# EAGLE board 6matrix (EAGLE 9.3.1), part 1 of 2
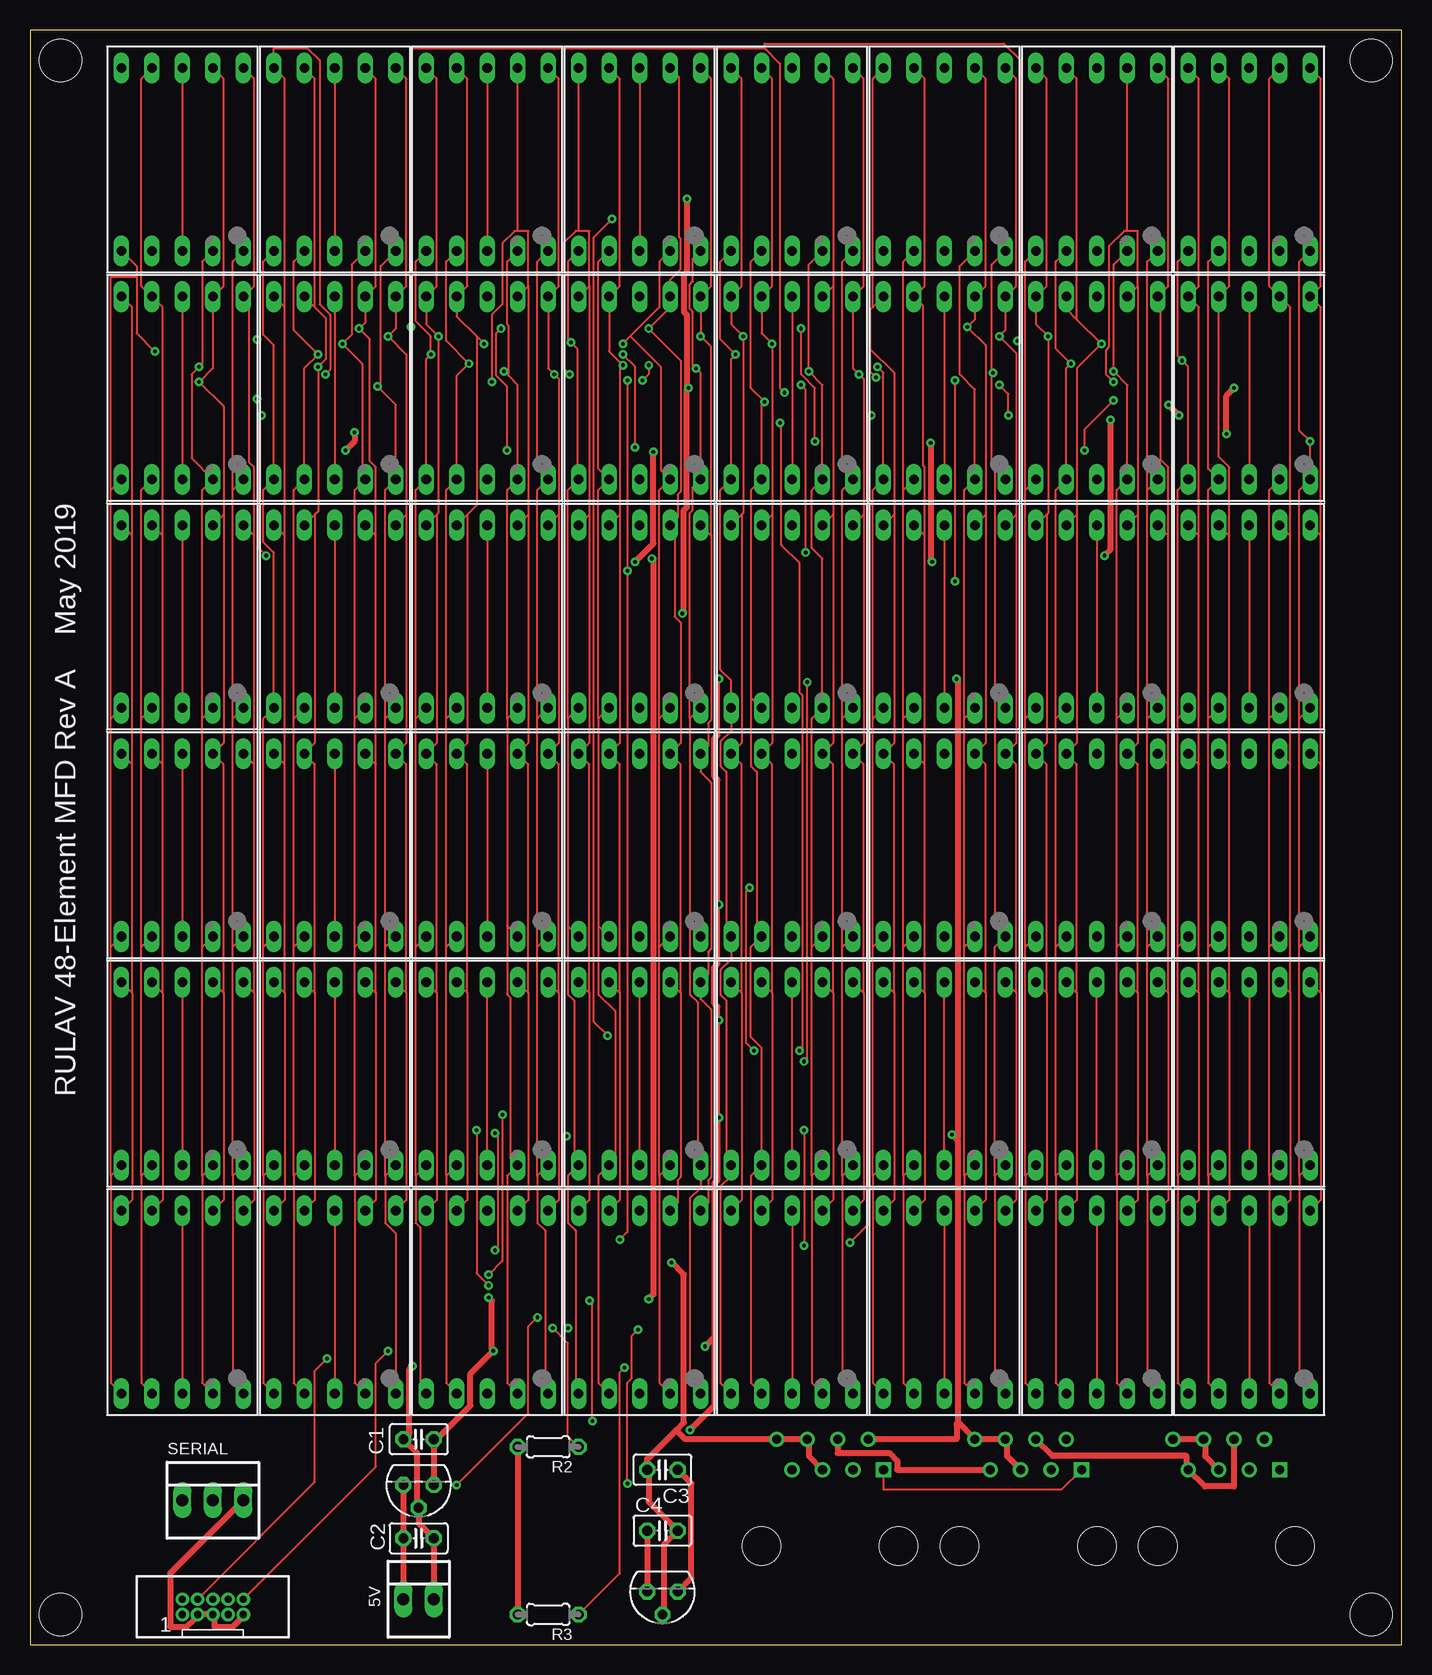
[diagram p4: board, top side]
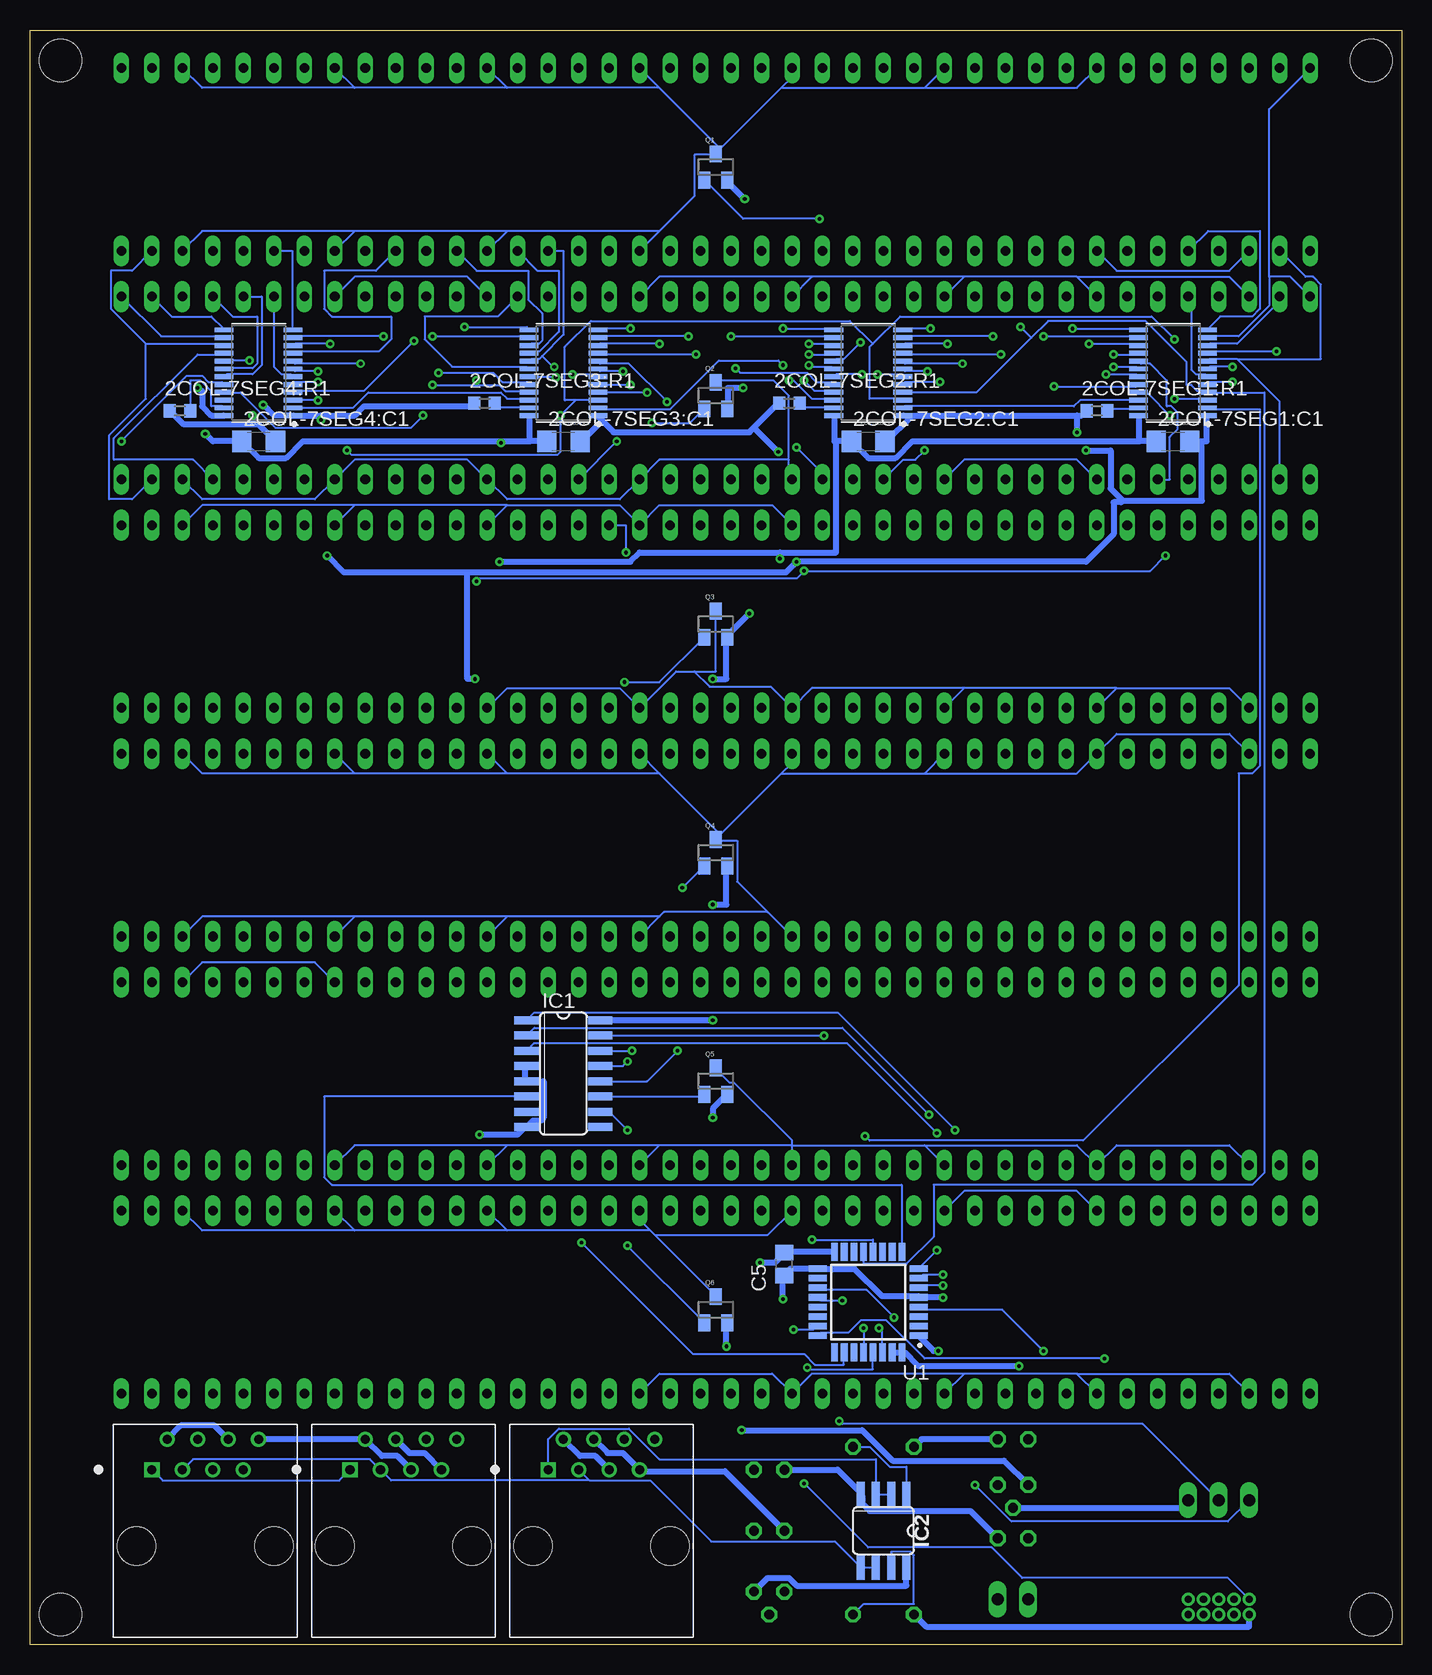
[diagram p5: board, bottom side, seen from below]

Size 114.3 x 134.62 mm. Coordinates in mm from the lower left corner, seen from the top.
Outline: 0,0 114.3,0 114.3,134.62 0,134.62 0,0
Copper layers (1*16): Top 0.035mm / dielectric 1.5mm / Bottom 0.035mm
Design rules "default *": minimum track width 6mil, minimum drill 0.3mm, track to track 6mil, track to pad 6mil, pad to pad 6mil, via to via 6mil, smd to smd 6mil, copper to edge 40mil, drill to drill 6mil, minimum pad ring 10mil, minimum via ring 8mil, stop-mask expansion 4mil, vias tented up to drill 13mil, thermal gap 10mil
Net classes: 0 default: width 0.152 mm, drill 0.152 mm, clearance 0.152 mm; 1 power: width 0.508 mm, drill 0.305 mm, clearance 0.152 mm to class 0, clearance 0.152 mm
Holes 3.5 mm at 2.54,2.54 111.76,2.54 2.54,132.08 111.76,132.08

## Footprints (pad centres in the part's own frame; a part is rotated, then mirrored left to right if it is on the bottom)
C1206 = smd 1.6 x 1.8: 1 -1.4,0; 2 1.4,0
SOP65P640X120-24 = smd 1.559 x 0.407: 1 -2.878,3.575; 2 -2.878,2.925; 3 -2.878,2.275; 4 -2.878,1.625; 5 -2.878,0.975; 6 -2.878,0.325; 7 -2.878,-0.325; 8 -2.878,-0.975; 9 -2.878,-1.625; 10 -2.878,-2.275; 11 -2.878,-2.925; 12 -2.878,-3.575; 13 2.878,-3.575; 14 2.878,-2.925; 15 2.878,-2.275; 16 2.878,-1.625; 17 2.878,-0.975; 18 2.878,-0.325; 19 2.878,0.325; 20 2.878,0.975; 21 2.878,1.625; 22 2.878,2.275; 23 2.878,2.925; 24 2.878,3.575
SA56-11 = drill 0.8 long: 1 -5.08,-7.62; 2 -2.54,-7.62; 3 0,-7.62; 4 2.54,-7.62; 5 5.08,-7.62; 6 5.08,7.62; 7 2.54,7.62; 8 0,7.62; 9 -2.54,7.62; 10 -5.08,7.62
R0603 = smd 1 x 1.1: 1 -0.85,0; 2 0.85,0
22-23-2021 = drill 1 long: 1 -1.27,0; 2 1.27,0
C025-025X050 = drill 0.813 octagon: 1 -1.27,0; 2 1.27,0
C0805 = smd 1.3 x 1.5: 1 -0.95,0; 2 0.95,0
SO16 = smd 0.66 x 2.032: 1 -4.445,-3.073; 2 -3.175,-3.073; 3 -1.905,-3.073; 4 -0.635,-3.073; 5 0.635,-3.073; 6 1.905,-3.073; 7 3.175,-3.073; 8 4.445,-3.073; 9 4.445,3.073; 10 3.175,3.073; 11 1.905,3.073; 12 0.635,3.073; 13 -0.635,3.073; 14 -1.905,3.073; 15 -3.175,3.073; 16 -4.445,3.073
SO08 = smd 0.66 x 2.032: 1 -1.905,-3.073; 2 -0.635,-3.073; 3 0.635,-3.073; 4 1.905,-3.073; 5 1.905,3.073; 6 0.635,3.073; 7 -0.635,3.073; 8 -1.905,3.073
TO92 = drill 0.813 octagon: 1 -1.27,0; 2 0,1.905; 3 1.27,0
CORTEX_HEADER = drill 0.6 pad 1: 1 -2.54,-0.635; 2 -2.54,0.635; 3 -1.27,-0.635; 4 -1.27,0.635; 5 0,-0.635; 6 0,0.635; 7 1.27,-0.635; 8 1.27,0.635; 9 2.54,-0.635; 10 2.54,0.635
SOT23 = smd 1 x 1.4: 1 -0.95,-1.1; 2 0.95,-1.1; 3 0,1.1
0204/5 = drill 0.813 octagon: 1 -2.54,0; 2 2.54,0
22-23-2031 = drill 1 long: 1 -2.54,0; 2 0,0; 3 2.54,0
QFP80P900X900X160-32N = smd 1.5 x 0.55: 1 -4.2,2.8; 2 -4.2,2; 3 -4.2,1.2; 4 -4.2,0.4; 5 -4.2,-0.4; 6 -4.2,-1.2; 7 -4.2,-2; 8 -4.2,-2.8; 17 4.2,-2.8; 18 4.2,-2; 19 4.2,-1.2; 20 4.2,-0.4; 21 4.2,0.4; 22 4.2,1.2; 23 4.2,2; 24 4.2,2.8 | smd 0.55 x 1.5: 9 -2.8,-4.2; 10 -2,-4.2; 11 -1.2,-4.2; 12 -0.4,-4.2; 13 0.4,-4.2; 14 1.2,-4.2; 15 2,-4.2; 16 2.8,-4.2; 25 2.8,4.2; 26 2,4.2; 27 1.2,4.2; 28 0.4,4.2; 29 -0.4,4.2; 30 -1.2,4.2; 31 -2,4.2; 32 -2.8,4.2
AMPHENOL_54602-908LF = drill 0.76 square: 1 -4.445,6.35 | drill 0.76: 2 -3.175,8.89; 3 -1.905,6.35; 4 -0.635,8.89; 5 0.635,6.35; 6 1.905,8.89; 7 3.175,6.35; 8 4.445,8.89 | hole 3.2: -5.715,0; 5.715,0

## Placement (x,y rotation side)
2COL-7SEG1:C1  1uF  [C1206]  19.05,100.33 0 bottom
2COL-7SEG1:IC1  STP16CPC26XTR  [SOP65P640X120-24]  19.05,106.05 180 bottom
2COL-7SEG1:LED1  7-SEG_SA56-11  [SA56-11]  12.7,123.83 0 top
2COL-7SEG1:LED2  7-SEG_SA56-11  [SA56-11]  12.7,104.78 0 top
2COL-7SEG1:LED3  7-SEG_SA56-11  [SA56-11]  12.7,85.72 0 top
2COL-7SEG1:LED4  7-SEG_SA56-11  [SA56-11]  12.7,66.67 0 top
2COL-7SEG1:LED5  7-SEG_SA56-11  [SA56-11]  12.7,47.62 0 top
2COL-7SEG1:LED6  7-SEG_SA56-11  [SA56-11]  12.7,28.57 0 top
2COL-7SEG1:LED7  7-SEG_SA56-11  [SA56-11]  25.4,123.83 0 top
2COL-7SEG1:LED8  7-SEG_SA56-11  [SA56-11]  25.4,104.78 0 top
2COL-7SEG1:LED9  7-SEG_SA56-11  [SA56-11]  25.4,85.72 0 top
2COL-7SEG1:LED10  7-SEG_SA56-11  [SA56-11]  25.4,66.67 0 top
2COL-7SEG1:LED11  7-SEG_SA56-11  [SA56-11]  25.4,47.62 0 top
2COL-7SEG1:LED12  7-SEG_SA56-11  [SA56-11]  25.4,28.57 0 top
2COL-7SEG1:R1  [R0603]  25.4,102.87 0 bottom
2COL-7SEG2:C1  1uF  [C1206]  44.45,100.33 0 bottom
2COL-7SEG2:IC1  STP16CPC26XTR  [SOP65P640X120-24]  44.45,106.05 180 bottom
2COL-7SEG2:LED1  7-SEG_SA56-11  [SA56-11]  38.1,123.83 0 top
2COL-7SEG2:LED2  7-SEG_SA56-11  [SA56-11]  38.1,104.78 0 top
2COL-7SEG2:LED3  7-SEG_SA56-11  [SA56-11]  38.1,85.72 0 top
2COL-7SEG2:LED4  7-SEG_SA56-11  [SA56-11]  38.1,66.67 0 top
2COL-7SEG2:LED5  7-SEG_SA56-11  [SA56-11]  38.1,47.62 0 top
2COL-7SEG2:LED6  7-SEG_SA56-11  [SA56-11]  38.1,28.57 0 top
2COL-7SEG2:LED7  7-SEG_SA56-11  [SA56-11]  50.8,123.83 0 top
2COL-7SEG2:LED8  7-SEG_SA56-11  [SA56-11]  50.8,104.78 0 top
2COL-7SEG2:LED9  7-SEG_SA56-11  [SA56-11]  50.8,85.72 0 top
2COL-7SEG2:LED10  7-SEG_SA56-11  [SA56-11]  50.8,66.67 0 top
2COL-7SEG2:LED11  7-SEG_SA56-11  [SA56-11]  50.8,47.62 0 top
2COL-7SEG2:LED12  7-SEG_SA56-11  [SA56-11]  50.8,28.57 0 top
2COL-7SEG2:R1  [R0603]  51.02,103.5 0 bottom
2COL-7SEG3:C1  1uF  [C1206]  69.85,100.33 0 bottom
2COL-7SEG3:IC1  STP16CPC26XTR  [SOP65P640X120-24]  69.85,106.05 180 bottom
2COL-7SEG3:LED1  7-SEG_SA56-11  [SA56-11]  63.5,123.83 0 top
2COL-7SEG3:LED2  7-SEG_SA56-11  [SA56-11]  63.5,104.78 0 top
2COL-7SEG3:LED3  7-SEG_SA56-11  [SA56-11]  63.5,85.72 0 top
2COL-7SEG3:LED4  7-SEG_SA56-11  [SA56-11]  63.5,66.67 0 top
2COL-7SEG3:LED5  7-SEG_SA56-11  [SA56-11]  63.5,47.62 0 top
2COL-7SEG3:LED6  7-SEG_SA56-11  [SA56-11]  63.5,28.57 0 top
2COL-7SEG3:LED7  7-SEG_SA56-11  [SA56-11]  76.2,123.83 0 top
2COL-7SEG3:LED8  7-SEG_SA56-11  [SA56-11]  76.2,104.78 0 top
2COL-7SEG3:LED9  7-SEG_SA56-11  [SA56-11]  76.2,85.72 0 top
2COL-7SEG3:LED10  7-SEG_SA56-11  [SA56-11]  76.2,66.67 0 top
2COL-7SEG3:LED11  7-SEG_SA56-11  [SA56-11]  76.2,47.62 0 top
2COL-7SEG3:LED12  7-SEG_SA56-11  [SA56-11]  76.2,28.57 0 top
2COL-7SEG3:R1  [R0603]  76.42,103.5 0 bottom
2COL-7SEG4:C1  1uF  [C1206]  95.25,100.33 0 bottom
2COL-7SEG4:IC1  STP16CPC26XTR  [SOP65P640X120-24]  95.25,106.05 180 bottom
2COL-7SEG4:LED1  7-SEG_SA56-11  [SA56-11]  88.9,123.83 0 top
2COL-7SEG4:LED2  7-SEG_SA56-11  [SA56-11]  88.9,104.78 0 top
2COL-7SEG4:LED3  7-SEG_SA56-11  [SA56-11]  88.9,85.72 0 top
2COL-7SEG4:LED4  7-SEG_SA56-11  [SA56-11]  88.9,66.67 0 top
2COL-7SEG4:LED5  7-SEG_SA56-11  [SA56-11]  88.9,47.62 0 top
2COL-7SEG4:LED6  7-SEG_SA56-11  [SA56-11]  88.9,28.57 0 top
2COL-7SEG4:LED7  7-SEG_SA56-11  [SA56-11]  101.6,123.83 0 top
2COL-7SEG4:LED8  7-SEG_SA56-11  [SA56-11]  101.6,104.78 0 top
2COL-7SEG4:LED9  7-SEG_SA56-11  [SA56-11]  101.6,85.72 0 top
2COL-7SEG4:LED10  7-SEG_SA56-11  [SA56-11]  101.6,66.67 0 top
2COL-7SEG4:LED11  7-SEG_SA56-11  [SA56-11]  101.6,47.62 0 top
2COL-7SEG4:LED12  7-SEG_SA56-11  [SA56-11]  101.6,28.57 0 top
2COL-7SEG4:R1  [R0603]  101.81,102.87 0 bottom
5V  22-23-2021  [22-23-2021]  32.38,3.81 0 top
C1  1uF  [C025-025X050]  32.38,17.14 180 top
C2  10uF  [C025-025X050]  32.38,8.89 0 top
C3  10uF  [C025-025X050]  52.7,14.61 180 top
C4  1uF  [C025-025X050]  52.7,9.53 0 top
C5  1uF  [C0805]  51.44,31.75 90 bottom
IC1  74S138D  [SO16]  69.85,47.62 270 bottom
IC2  PCA9600SO8  [SO08]  43.18,9.53 180 bottom
IC3  7803  [TO92]  32.38,13.34 180 top
IC4  7810  [TO92]  52.7,4.45 180 top
PROG  CORTEX_HEADERJ  [CORTEX_HEADER]  15.24,3.17 0 top
Q1  MOSFET-PCHANNEL  [SOT23]  57.15,123.19 0 bottom
Q2  MOSFET-PCHANNEL  [SOT23]  57.15,104.14 0 bottom
Q3  MOSFET-PCHANNEL  [SOT23]  57.15,85.09 0 bottom
Q4  MOSFET-PCHANNEL  [SOT23]  57.15,66.04 0 bottom
Q5  MOSFET-PCHANNEL  [SOT23]  57.15,46.99 0 bottom
Q6  MOSFET-PCHANNEL  [SOT23]  57.15,27.94 0 bottom
R2  2k  [0204/5]  43.18,16.51 180 top
R3  2k  [0204/5]  43.18,2.54 180 top
SERIAL  22-23-2031  [22-23-2031]  15.24,12.06 0 top
U1  STM32F303K8T6  [QFP80P900X900X160-32N]  44.45,28.57 180 bottom
U$1  54602-908LF  [AMPHENOL_54602-908LF]  83.19,8.26 0 bottom
U$2  54602-908LF  [AMPHENOL_54602-908LF]  99.69,8.26 0 bottom
U$3  54602-908LF  [AMPHENOL_54602-908LF]  66.67,8.26 0 bottom